# EAGLE design IMD_Fixed (EAGLE 9.2.2)

## Sheet 1 of 2: IMD
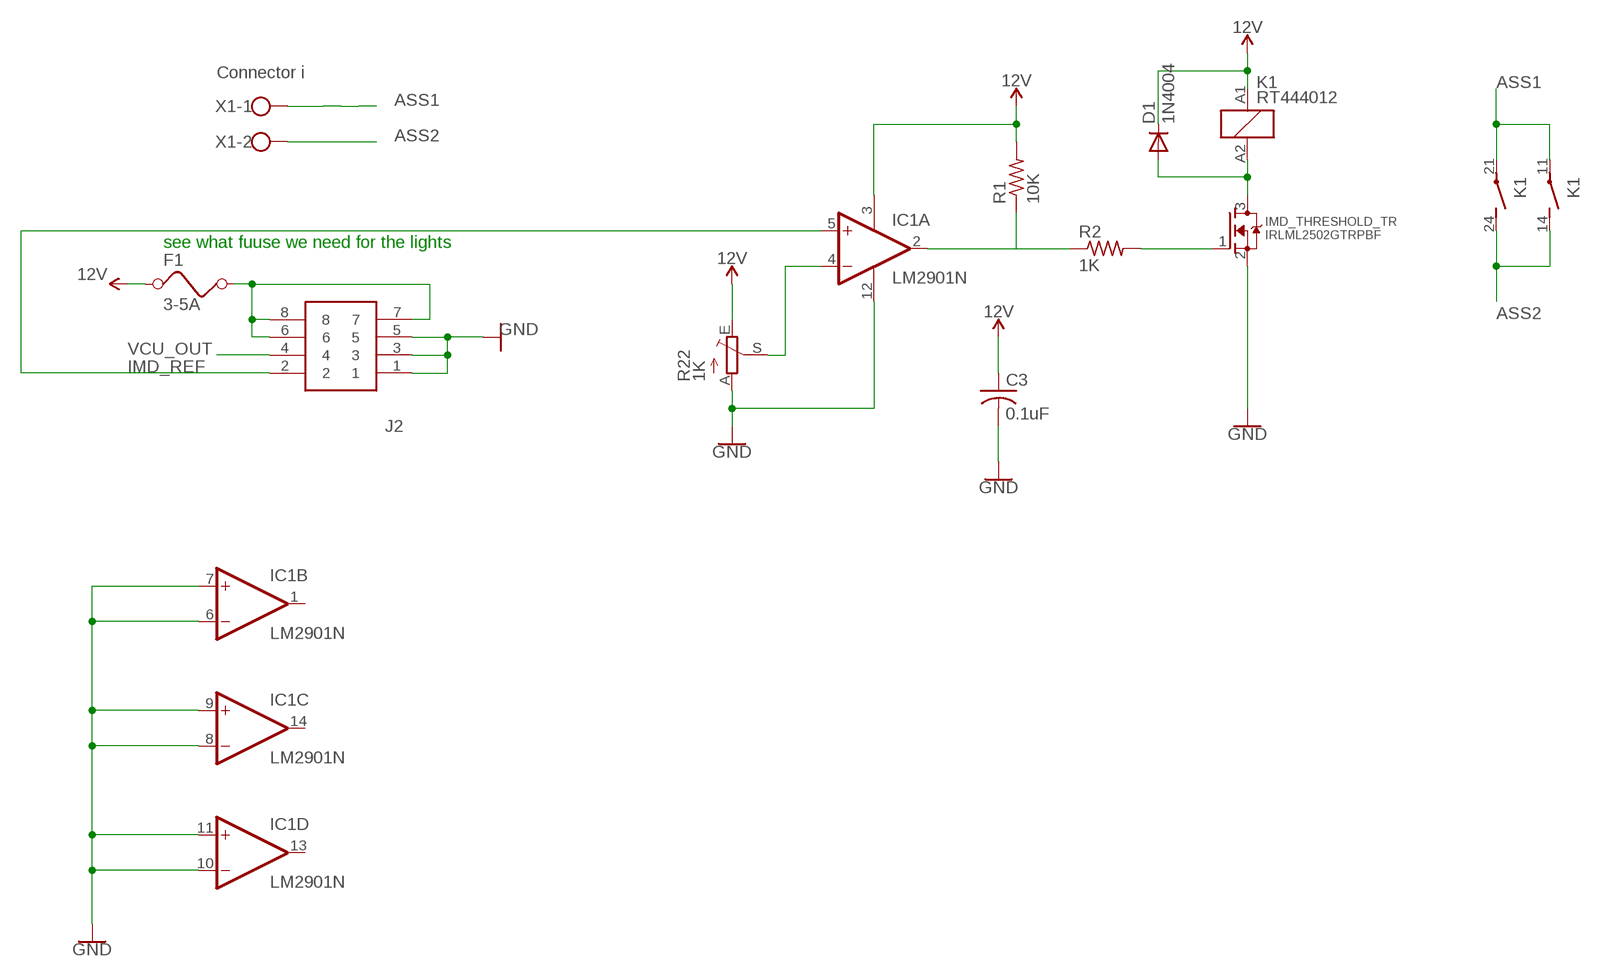
[diagram p0: schematic, sheet 1]

### Parts
C3  0.1uF  C-US050-024X044  [C050-024X044]
D1  1N4004  [DO41-10]
F1  3-5A  FUSE  [FUSE]
IC1  LM2901N  [DIL14]
IMD_THRESHOLD_TR  IRLML2502GTRPBF  MOSFET-NREFLOW  [SOT23]
J2  T821108A1S100CEU  [HDRV8W64P254_2X4_1778X895X915P]
K1  RT444012  [RT2N/O]
R1  10K  R-US_R0805  [R0805]
R2  1K  R-US_R0805  [R0805]
R22  1K  TRIM_EU-B90P  [SP19L]
X1  Connector i  W237-102  [W237-102]

### Nets
12V: C3.1 D1.C F1.1 IC1.3(P:V+) K1.A1 R1.2 R22.E ; also sheet 2
ASS1: K1.11(2:P) K1.21(3:P) X1.1
ASS2: K1.14(2:S) K1.24(3:S) X1.2
GND: C3.2 IC1.6(B:-IN) IC1.7(B:+IN) IC1.8(C:-IN) IC1.9(C:+IN) IC1.10(D:-IN) IC1.11(D:+IN) IC1.12(P:V-) IMD_THRESHOLD_TR.2(S) J2.1 J2.3 J2.5 R22.A ; also sheet 2
IMD_REF: IC1.5(A:+IN) J2.2
N$1: IC1.2(A:OUT) R1.1 R2.1
N$2: F1.2 J2.6 J2.7 J2.8
N$3: IMD_THRESHOLD_TR.1(G) R2.2
N$4: IC1.4(A:-IN) R22.S
N$6: D1.A IMD_THRESHOLD_TR.3(D) K1.A2
VCU_OUT: J2.4 ; also sheet 2
Unconnected: IC1.1(B:OUT) IC1.13(D:OUT) IC1.14(C:OUT)

### Notes on the sheet
- see what fuuse we need for the lights

## Sheet 2 of 2: TSAL
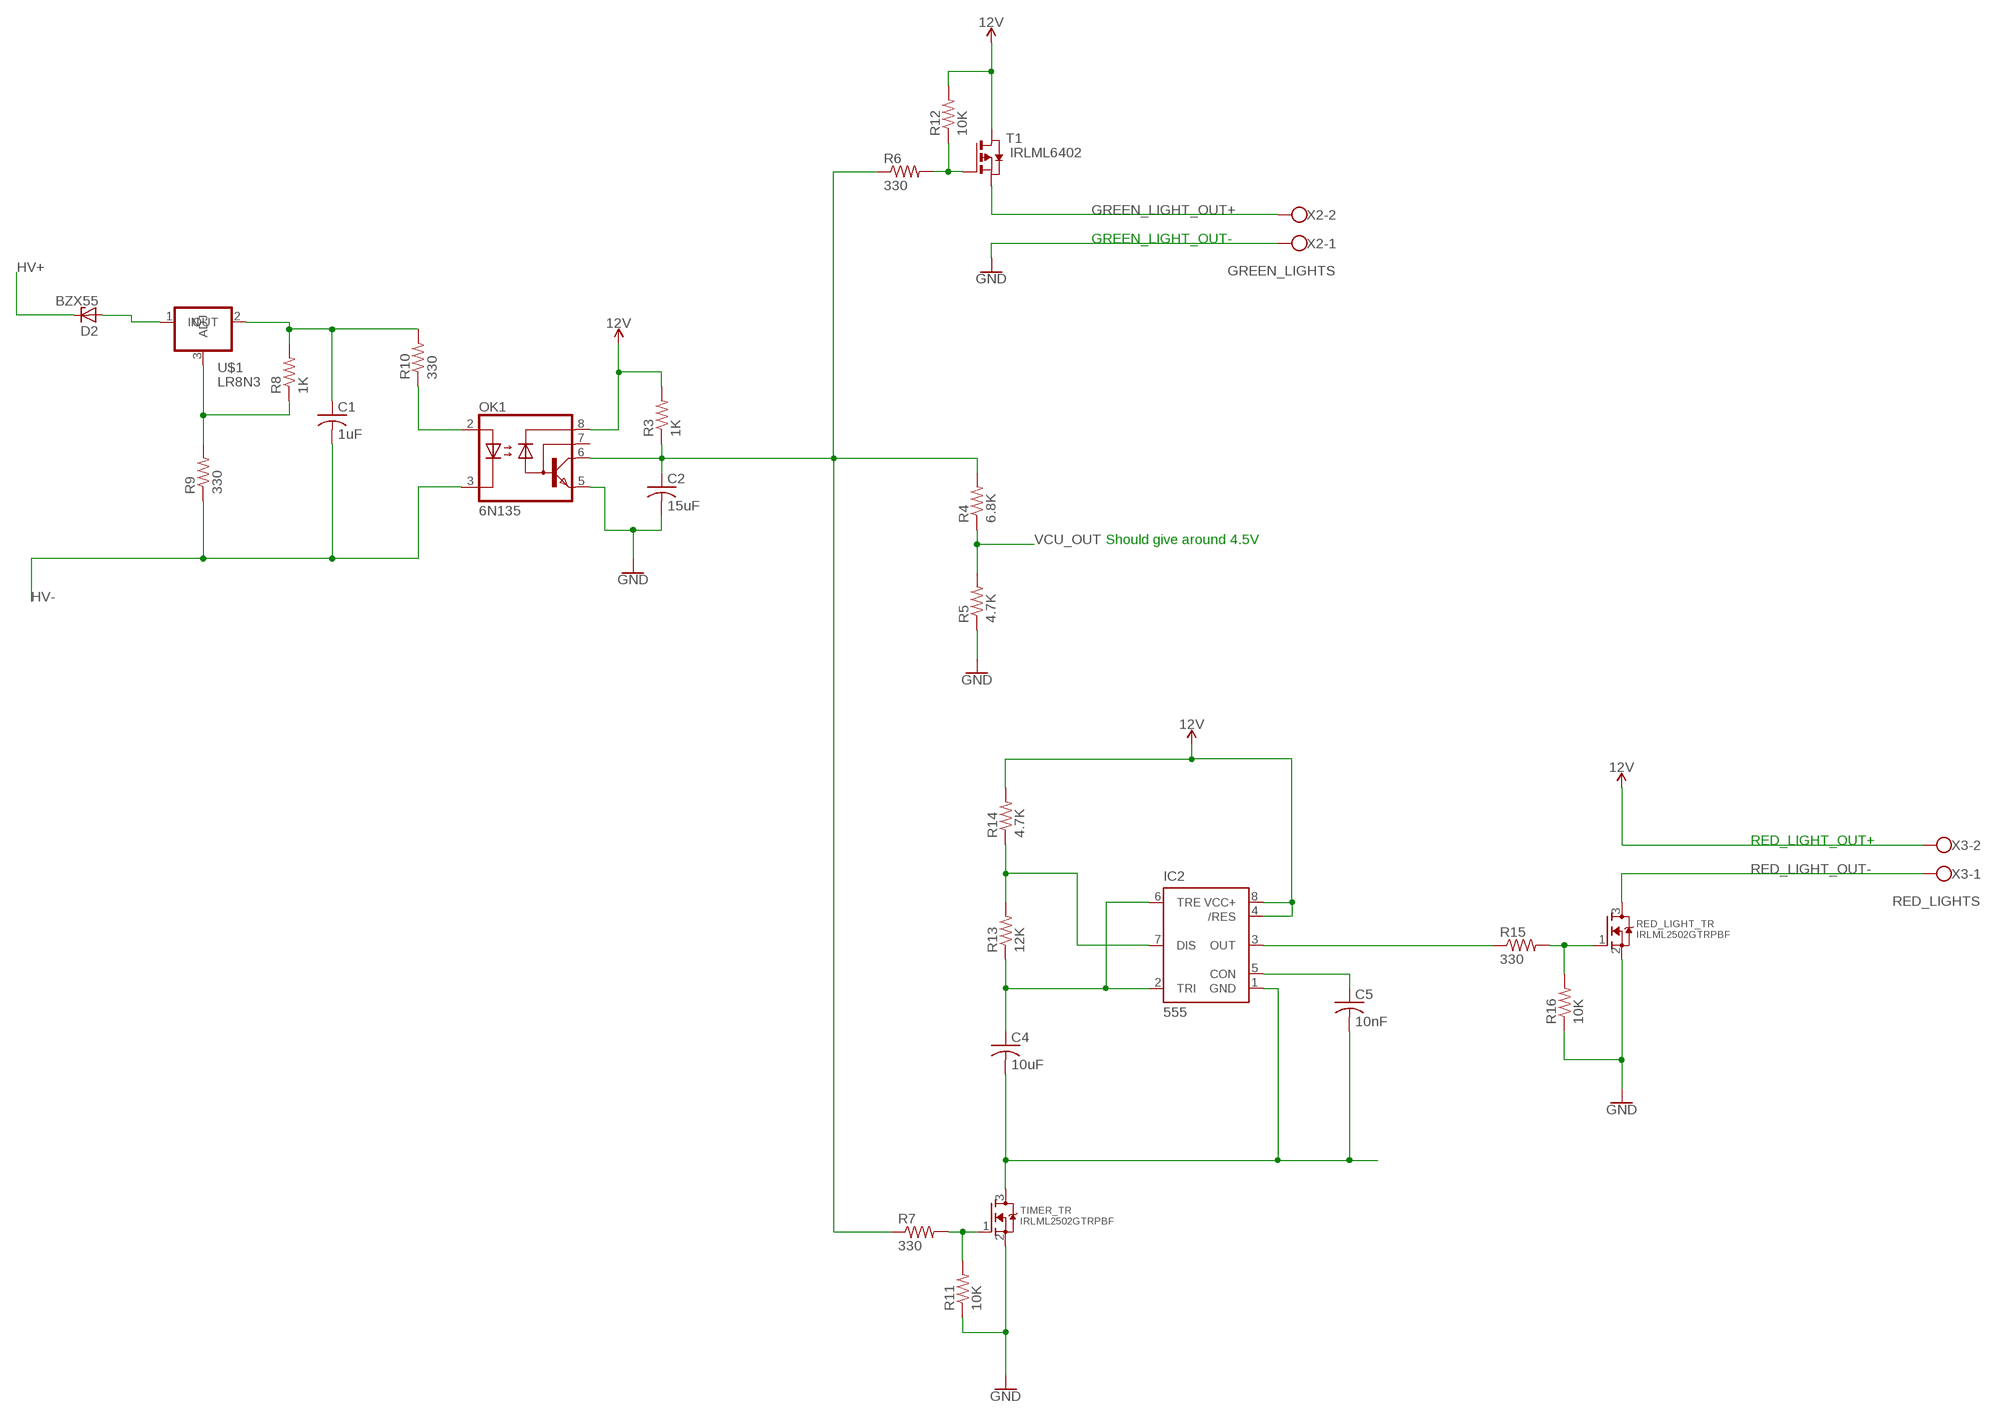
[diagram p1: schematic, sheet 2]

### Parts
C1  1uF  C-US050-024X044  [C050-024X044]
C2  15uF  C-US050-024X044  [C050-024X044]
C4  10uF  C-US050-024X044  [C050-024X044]
C5  10nF  C-US050-024X044  [C050-024X044]
D2  BZX55  [DO35Z10]
IC2  555  555KIT  [DIP08-KIT]
OK1  6N135  [DIL08]
R3  1K  R-US_M0805  [M0805]
R4  6.8K  R-US_M0805  [M0805]
R5  4.7K  R-US_M0805  [M0805]
R6  330  R-US_M0805  [M0805]
R7  330  R-US_M0805  [M0805]
R8  1K  R-US_0204/7  [0204/7]
R9  330  R-US_0204/7  [0204/7]
R10  330  R-US_0204/7  [0204/7]
R11  10K  R-US_M0805  [M0805]
R12  10K  R-US_M0805  [M0805]
R13  12K  R-US_M0805  [M0805]
R14  4.7K  R-US_M0805  [M0805]
R15  330  R-US_M0805  [M0805]
R16  10K  R-US_M0805  [M0805]
RED_LIGHT_TR  IRLML2502GTRPBF  MOSFET-NREFLOW  [SOT23]
T1  IRLML6402  PMOSSOT23  [SOT-23]
TIMER_TR  IRLML2502GTRPBF  MOSFET-NREFLOW  [SOT23]
U$1  LR8N3  N3  [N3]
X2  GREEN_LIGHTS  W237-102  [W237-102]
X3  RED_LIGHTS  W237-102  [W237-102]

### Nets
12V: IC2.4(/RES) IC2.8(VCC+) OK1.8(VCC) R3.2 R12.2 R14.2 T1.1(D) X3.2 ; also sheet 1
GND: C2.2 OK1.5(GND) R5.1 R11.1 R16.1 RED_LIGHT_TR.2(S) TIMER_TR.2(S) X2.1 ; also sheet 1
GREEN_LIGHT_OUT+: T1.2(S) X2.2
HV+: D2.C
HV-: C1.2 OK1.3(C) R9.1
N$5: D2.A U$1.1(IN)
N$7: R8.1 R9.2 U$1.3(ADJ)
N$8: OK1.2(A) R10.1
N$9: C1.1 R8.2 R10.2 U$1.2(OUT)
N$10: C2.1 OK1.6(VO) R3.1 R4.2 R6.1 R7.1
N$11: R6.2 R12.1 T1.3(G)
N$12: R7.2 R11.2 TIMER_TR.1(G)
N$13: C4.2 C5.2 IC2.1(GND) TIMER_TR.3(D)
N$14: R15.2 R16.2 RED_LIGHT_TR.1(G)
N$15: IC2.7(DIS) R13.2 R14.1
N$16: C4.1 IC2.2(TRI) IC2.6(TRE) R13.1
N$17: C5.1 IC2.5(CON)
N$18: IC2.3(OUT) R15.1
RED_LIGHT_OUT-: RED_LIGHT_TR.3(D) X3.1
VCU_OUT: R4.1 R5.2 ; also sheet 1
Unconnected: OK1.7(VB)

### Notes on the sheet
- GREEN_LIGHT_OUT-
- Should give around 4.5V
- RED_LIGHT_OUT+

## Library data of the parts
C1-C5 = adafruit:C-US: CAPACITOR, American symbol
D1 = adafruit:1N4004: DIODE General purpose 1N400x type rectifier (With bigger pads) http://www.ladyada.net/library/pcb/eaglelibrary.html
D2 = diode:BZX55: Z DIODE
F1 = special:FUSE: FUSE 5 x 20 mm
IC1 = linear:LM2901: COMPARATOR
IC2 = SparkFun-IC-Special-Function:555: General purpose bipolar Timer Datasheet <http://www.sparkfun.com/datasheets/Components/General/ne555.pdf> SparkFun Products SparkFun SparkPunk Sequencer Kit <https://www.sparkfun.com/products/12707> (KIT-12707) Storefront Component: 555 Timer <https://www.sparkfun.com/products/9273> (COM-09273) Two parts valid for production: VFP: IC-11930 (M7555 PTH) VFP: IC-09173 (555 PTH) - Preferred; PROD_ID: IC-09173; PROD_ID_ALT: IC-11930
IMD_THRESHOLD_TR RED_LIGHT_TR TIMER_TR = adafruit:MOSFET-N: N-Channel Mosfet 2N7002E - 60V 260mA SOT23 [Digikey: 2N7002ET1GOSTR-ND] - REEL BSH103 - 30V 850mA SOT23 [Digikey: 568-5013-1-ND]
J2 = T821108A1S100CEU:T821108A1S100CEU: HEADER, VERTICAL, 2.54MM, 8WAY Amphenol T821 Series, 2.54mm Pitch 8 Way 2 Row Straight PCB Header, Solder Termination, 3A Source: Datasheet <http://uk.rs-online.com/web/p/products/1702738>; DESCRIPTION: HEADER, VERTICAL, 2.54MM, 8WAY Amphenol T821 Series, 2.54mm Pitch 8 Way 2 Row Straight PCB Header, Solder Termination, 3A; HEIGHT: 9.15mm; MANUFACTURER_NAME: Amphenol; MANUFACTURER_PART_NUMBER: T821108A1S100CEU; RS_PART_NUMBER: 1702738
K1 = relay:RT44?*: Power PCB Relay SCHRACK 2 pole 8 A, DC and AC-coil Source: http://www.schrack.com/.. 5842.pdf; OC_FARNELL: unknown; OC_NEWARK: unknown
OK1 = optocoupler:6N135: MOTOROLA OPTO COUPLER; MF: FAIRCHILD SEMICONDUCTOR; MPN: 6N135; OC_FARNELL: 1021342; OC_NEWARK: 58K9658
R1-R16 = adafruit:R-US_: RESISTOR, American symbol
R22 = pot:TRIM_EU-: POTENTIOMETER
T1 = zetex:PMOSSOT23: MOS FET; OC_FARNELL: unknown; OC_NEWARK: unknown
U$1 = v-reg_supertex:N3: LR8 or LR12 [TO-92]
X1-X3 = con-wago-500:W237-102: WAGO SCREW CLAMP; MPN: 237-102; OC_FARNELL: unknown; OC_NEWARK: 70K9898

## Board
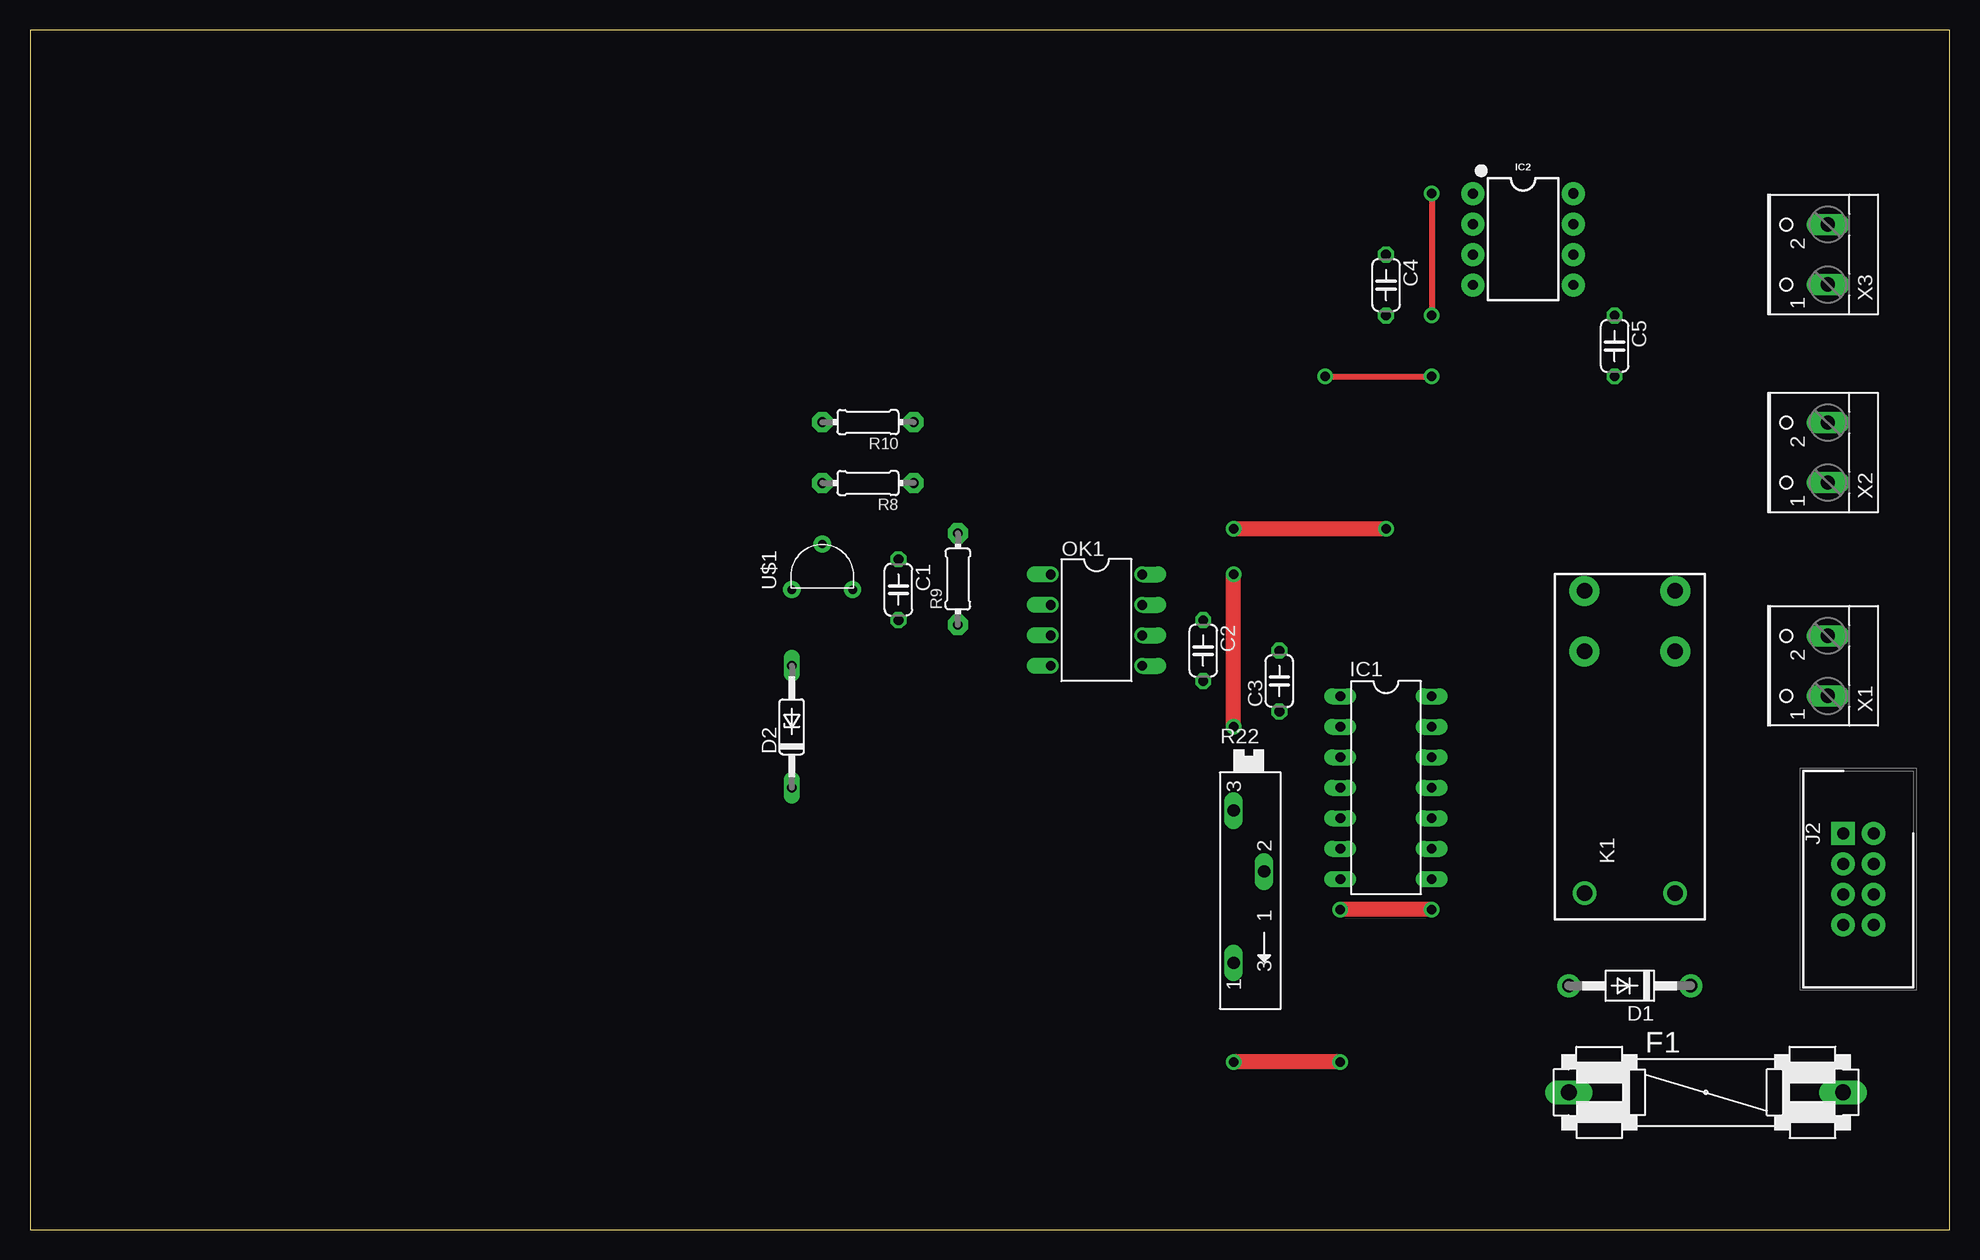
[diagram p2: board, top side]
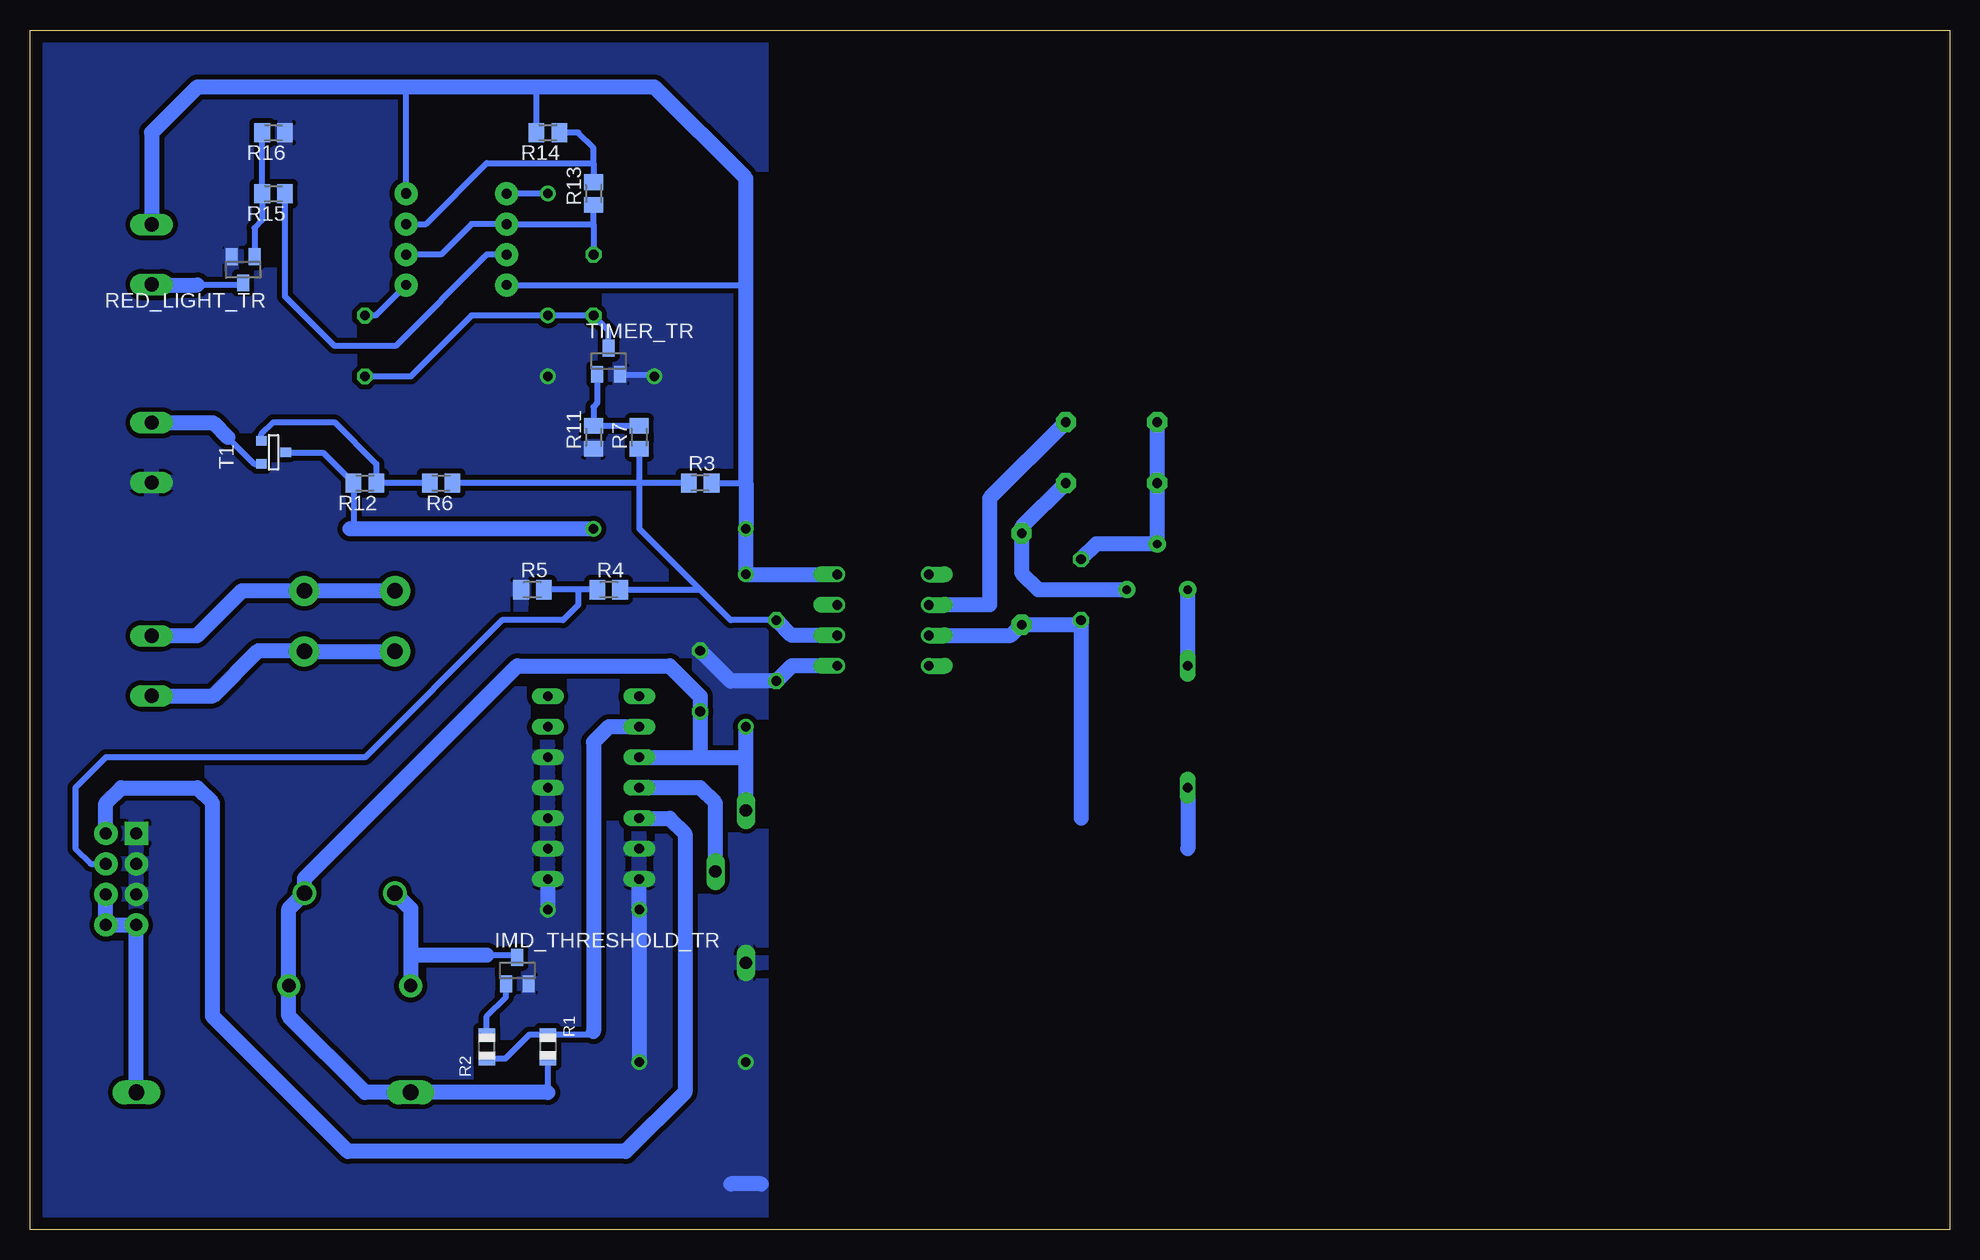
[diagram p3: board, bottom side, seen from below]

Size 160 x 100 mm. Coordinates in mm from the lower left corner, seen from the top.
Outline: 0,0 160,0 160,100 0,100 0,0
Copper layers (1*16): Top 0.035mm / dielectric 1.5mm / Bottom 0.035mm
Design rules "default *": minimum track width 6mil, minimum drill 0.35mm, track to track 16mil, track to pad 16mil, pad to pad 16mil, via to via 16mil, smd to smd 16mil, copper to edge 40mil, drill to drill 6mil, minimum pad ring 10mil, minimum via ring 8mil, stop-mask expansion 4mil, vias tented up to drill 0mil, thermal gap 10mil

### Footprints (pad centres in the part's own frame; a part is rotated, then mirrored left to right if it is on the bottom)
C050-024X044 = drill 0.813 octagon: 1 -2.54,0; 2 2.54,0
DO41-10 = drill 1.118 pad 1.93: A 5.08,0; C -5.08,0
DO35Z10 = drill 0.813 long: A 5.08,0; C -5.08,0
FUSE = drill 1.321 long: 1 -11.43,0; 2 11.43,0
DIL14 = drill 0.813 long: 1 -7.62,-3.81; 2 -5.08,-3.81; 3 -2.54,-3.81; 4 0,-3.81; 5 2.54,-3.81; 6 5.08,-3.81; 7 7.62,-3.81; 8 7.62,3.81; 9 5.08,3.81; 10 2.54,3.81; 11 0,3.81; 12 -2.54,3.81; 13 -5.08,3.81; 14 -7.62,3.81
DIP08-KIT = drill 0.813 pad 1.905: 1 -3.81,-4.191; 2 -1.27,-4.191; 3 1.27,-4.191; 4 3.81,-4.191; 5 3.81,4.191; 6 1.27,4.191; 7 -1.27,4.191 | drill 0.864 pad 1.905: 8 -3.81,4.191
SOT23 = smd 1 x 1.4: 1 -0.95,-1.1; 2 0.95,-1.1; 3 0,1.1
HDRV8W64P254_2X4_1778X895X915P = drill 1 pad 1.93 square: 1 0,0 | drill 1 pad 1.93: 2 0,2.54; 3 2.54,0; 4 2.54,2.54; 5 5.08,0; 6 5.08,2.54; 7 7.62,0; 8 7.62,2.54
RT2N/O = drill 1.3 pad 2.5: 11 7.56,-3.78; 14 12.6,-3.78; 21 7.56,3.78; 24 12.6,3.78 | drill 1.3: A1 -12.6,-3.78; A2 -12.6,3.78
DIL08 = drill 0.813 offset: 1 -3.81,-3.81; 2 -1.27,-3.81; 3 1.27,-3.81; 4 3.81,-3.81; 5 3.81,3.81; 6 1.27,3.81; 7 -1.27,3.81; 8 -3.81,3.81
R0805 = smd 1.1 x 1.4: 1 -1,0; 2 1,0
M0805 = smd 1.3 x 1.6: 1 -0.95,0; 2 0.95,0
0204/7 = drill 0.813 pad 1.676 octagon: 1 -3.81,0; 2 3.81,0
SP19L = drill 1.016 long: A 5.715,-1.27; E -6.985,-1.27; S -1.905,1.27
SOT-23 = smd 0.787 x 0.889: 1 0.025,-1.016; 2 -0.94,1.016; 3 0.991,1.016
N3 = drill 0.7 pad 1.422: 1 -2.54,-1.27; 2 0,2.54; 3 2.54,-1.27
W237-102 = drill 1.194 long: 1 -2.5,-1.27; 2 2.5,-1.27

### Placement (x,y rotation side)
C1  72.39,53.34 270 top
C2  97.79,48.26 270 top
C3  104.14,45.72 90 top
C4  113.03,78.74 270 top
C5  132.08,73.66 270 top
D1  133.35,20.32 180 top
D2  63.5,41.91 90 top
F1  139.7,11.43 0 top
IC1  113.03,36.83 270 top
IC2  124.46,82.55 270 top
IMD_THRESHOLD_TR  119.38,21.59 0 bottom
J2  151.13,33.02 270 top
K1  133.35,40.64 90 top
OK1  88.9,50.8 270 top
R1  116.84,15.24 270 bottom
R2  121.92,15.24 90 bottom
R3  104.14,62.23 0 bottom
R4  111.76,53.34 0 bottom
R5  118.11,53.34 0 bottom
R6  125.73,62.23 180 bottom
R7  109.22,66.04 90 bottom
R8  69.85,62.23 180 top
R9  77.34,54.23 90 top
R10  69.85,67.31 180 top
R11  113.03,66.04 90 bottom
R12  132.08,62.23 180 bottom
R13  113.03,86.36 90 bottom
R14  116.84,91.44 180 bottom
R15  139.7,86.36 180 bottom
R16  139.7,91.44 180 bottom
R22  101.6,27.94 270 top
RED_LIGHT_TR  142.24,80.01 180 bottom
T1  139.7,64.77 90 bottom
TIMER_TR  111.76,72.39 0 bottom
U$1  66.04,54.61 0 top
X1  148.59,46.99 90 top
X2  148.59,64.77 90 top
X3  148.59,81.28 90 top

### Tracks (layer width: path | path; a pad name or v marks a point on that pad's centre or on a via)
12V  (via drill 0.8 pad 1.3)
  Top 1.27: v100.33,41.91 v100.33,54.61 | v100.33,58.42 v113.03,58.42
  Bottom 0.508: R1.2 116.84,11.43 | R3.2 100.33,62.23 | T1.1 138.66,64.77 135.57,64.77 R12.2 133.03,58.74 133.35,58.42 | R14.2 117.79,94.93 118.11,95.25 | IC2.8 128.65,94.87 128.27,95.25 | IC2.4 100.33,78.74
  Bottom 1.27: R22.E 100.33,39.37 | 100.33,39.37 v100.33,41.91 | OK1.8 v100.33,54.61 v100.33,58.42 100.33,62.23 100.33,78.74 100.33,87.63 107.95,95.25 118.11,95.25 128.27,95.25 146.05,95.25 149.86,91.44 X3.2 | IC1.3 104.14,39.37 | 104.14,39.37 100.33,39.37 | 104.14,39.37 C3.1 104.14,44.45 106.68,46.99 119.38,46.99 137.13,29.24 K1.A1 138.43,26.74 D1.C 138.43,17.78 132.08,11.43 F1.1 116.84,11.43 | 133.35,58.42 v113.03,58.42
ASS1
  Bottom 1.27: X1.1 144.74,44.49 140.97,48.26 137.19,48.26 K1.11 K1.21
ASS2
  Bottom 1.27: K1.24 K1.14 142.34,53.24 146.09,49.49 X1.2
GND  (via drill 0.8 pad 1.3)
  Top 0.508: v107.95,71.12 v116.84,71.12
  Top 1.27: v116.84,26.67 v109.22,26.67 | v109.22,13.97 v100.33,13.97
  Bottom 0.508: TIMER_TR.2 108.12,71.29 v107.95,71.12
  Bottom 1.27: 99.06,3.81 101.6,3.81 | OK1.5 96.52,46.99 C2.2 101.6,45.72 C3.2 | IC1.8 v116.84,26.67 | IC1.7 v109.22,26.67 v109.22,13.97
  pour Bottom (isolate 0.406): 160.02,0 160.02,100.33 99.06,100.33 99.06,0
GREEN_LIGHT_OUT+
  Bottom 0.508: 143.51,66.04 141.3,63.83 T1.2
  Bottom 1.27: X2.2 144.74,67.27 143.51,66.04
HV+
  Bottom 1.27: D2.C 63.5,31.75
HV-
  Bottom 1.27: OK1.3 78.23,49.53 R9.1 72.77,50.42 C1.2 72.39,34.29
IMD_REF
  Bottom 1.27: IC1.5 106.68,34.29 105.41,33.02 105.41,11.43 110.34,6.5 133.5,6.5 144.78,17.78 144.78,35.56 146.05,36.83 152.4,36.83 153.67,35.56 J2.2
N$1
  Bottom 0.508: 113.03,16.51 113.3,16.24 R1.1 118.38,16.24 120.38,14.24 R2.1
  Bottom 1.27: IC1.2 111.76,41.91 113.03,40.64 113.03,16.51
N$2
  Bottom 1.27: F1.2 J2.7 J2.8 J2.6
N$3
  Bottom 0.508: R2.2 121.92,17.78 120.33,19.37 IMD_THRESHOLD_TR.1
N$4
  Bottom 1.27: R22.S 102.87,35.56 104.14,36.83 IC1.4
N$5
  Bottom 1.27: D2.A U$1.1
N$6
  Bottom 0.508: IMD_THRESHOLD_TR.3 119.55,22.86 121.92,22.86
  Bottom 1.27: K1.A2 128.27,26.74 128.27,22.86 | 128.27,22.86 D1.A | 121.92,22.86 128.27,22.86
N$7
  Bottom 1.27: U$1.3 75.95,53.34 77.34,54.74 R9.2 77.34,58.55 R8.1
N$8
  Bottom 1.27: R10.1 80.01,60.96 80.01,52.07 OK1.2
N$9
  Bottom 1.27: C1.1 71.12,57.15 U$1.2 R8.2 R10.2
N$10
  Bottom 0.508: C2.1 101.6,50.8 104.14,53.34 | R4.2 104.14,53.34 | R3.1 109.22,62.23 | R7.1 109.22,62.23 | 109.22,62.23 109.22,58.42 104.14,53.34 | 109.22,62.23 R6.1
  Bottom 1.27: OK1.6 96.52,49.53 C2.1
N$11
  Bottom 0.508: R6.2 R12.1 131.13,63.82 134.62,67.31 139.7,67.31 140.72,66.29 T1.3
N$12
  Bottom 0.508: R7.2 R11.2 113.03,68.58 112.71,68.9 TIMER_TR.1
N$13  (via drill 0.8 pad 1.3)
  Top 0.508: v116.84,86.36 v116.84,76.2
  Bottom 0.508: TIMER_TR.3 111.76,74.93 C4.2 v116.84,76.2 123.19,76.2 128.27,71.12 C5.2 | v116.84,86.36 IC2.1
N$14
  Bottom 0.508: R16.2 R15.2 140.65,84.14 141.29,83.5 RED_LIGHT_TR.1
N$15
  Bottom 0.508: IC2.7 127,83.82 121.92,88.9 113.03,88.9 | 113.03,88.9 R13.2 | 113.03,88.9 113.03,90.17 114.3,91.44 R14.1
N$16
  Bottom 0.508: 113.03,83.82 IC2.2 123.19,83.82 125.73,81.28 IC2.6 | 113.03,83.82 R13.1 | 113.03,83.82 C4.1
N$17
  Bottom 0.508: IC2.5 131.19,76.2 C5.1
N$18
  Bottom 0.508: IC2.3 121.92,81.28 129.54,73.66 134.62,73.66 138.75,77.79 R15.1
RED_LIGHT_OUT-
  Bottom 0.508: RED_LIGHT_TR.3 142.41,78.74 146.05,78.74
  Bottom 1.27: X3.1 149.82,78.74 146.05,78.74
VCU_OUT
  Bottom 0.508: R4.1 114.3,53.34 | 114.3,53.34 R5.2 | 114.3,53.34 114.3,52.07 115.57,50.8 120.65,50.8 132.08,39.37 153.67,39.37 156.21,36.83 156.21,31.75 154.94,30.48 J2.4